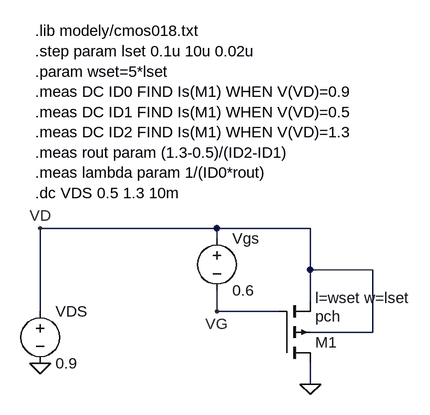
[diagram p0: schematic P1-mos.asc]
P1-mos.asc, the LTspice schematic file:
Version 4
SHEET 1 880 680
WIRE 80 64 -192 64
WIRE 224 64 80 64
WIRE 80 80 80 64
WIRE 224 128 224 64
WIRE 320 128 224 128
WIRE 224 176 224 128
WIRE -192 192 -192 64
WIRE 80 192 80 160
WIRE 176 192 80 192
WIRE 320 224 320 128
WIRE 320 224 224 224
WIRE 224 304 224 272
FLAG 224 304 0
FLAG -192 272 0
FLAG -192 64 VD
FLAG 80 192 VG
SYMBOL voltage 80 64 R0
WINDOW 123 0 0 Left 0
WINDOW 39 0 0 Left 0
SYMATTR InstName Vgs
SYMATTR Value 0.6
SYMBOL voltage -192 176 R0
WINDOW 123 0 0 Left 0
WINDOW 39 0 0 Left 0
SYMATTR InstName VDS
SYMATTR Value 0.9
SYMBOL pmos4 176 272 M180
WINDOW 123 56 101 Left 2
SYMATTR Value2 l=wset w=lset
SYMATTR InstName M1
SYMATTR Value pch
TEXT -200 -240 Left 2 !.lib modely/cmos018.txt\n.step param lset 0.1u 10u 0.02u\n.param wset=5*lset\n.meas DC ID0 FIND Is(M1) WHEN V(VD)=0.9\n.meas DC ID1 FIND Is(M1) WHEN V(VD)=0.5\n.meas DC ID2 FIND Is(M1) WHEN V(VD)=1.3\n.meas rout param (1.3-0.5)/(ID2-ID1)\n.meas lambda param 1/(ID0*rout)\n.dc VDS 0.5 1.3 10m

The netlist it stands for:
* P1-mos.asc
Vgs VD VG 0.6
VDS VD 0 0.9
M1 0 VG VD VD pch l=wset w=lset
.model NMOS NMOS
.model PMOS PMOS
.lib standard.mos
.lib modely/cmos018.txt
.step param lset 0.1u 10u 0.02u
.param wset=5*lset
.meas DC ID0 FIND Is(M1) WHEN V(VD)=0.9
.meas DC ID1 FIND Is(M1) WHEN V(VD)=0.5
.meas DC ID2 FIND Is(M1) WHEN V(VD)=1.3
.meas rout param (1.3-0.5)/(ID2-ID1)
.meas lambda param 1/(ID0*rout)
.dc VDS 0.5 1.3 10m
.backanno
.end

* Results of the author's LTspice run, read from the files saved beside the schematic
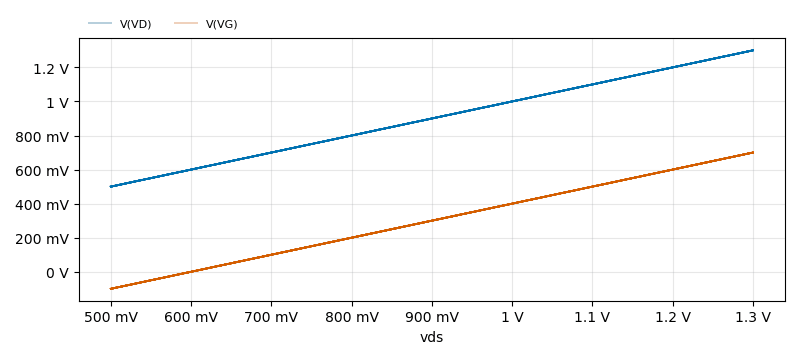
[diagram p1: DC transfer characteristic of P1-mos.asc, plotted from the saved traces]
* DC transfer characteristic, 496 runs:
*   V(VD) [run 1]: 500 mV at vds=500 mV, 1.3 V at vds=1.3 V, min 500 mV, max 1.3 V
*   V(VD) [run 2]: 500 mV at vds=500 mV, 1.3 V at vds=1.3 V, min 500 mV, max 1.3 V
*   V(VD) [run 3]: 500 mV at vds=500 mV, 1.3 V at vds=1.3 V, min 500 mV, max 1.3 V
*   V(VD) [run 4]: 500 mV at vds=500 mV, 1.3 V at vds=1.3 V, min 500 mV, max 1.3 V
*   V(VD) [run 5]: 500 mV at vds=500 mV, 1.3 V at vds=1.3 V, min 500 mV, max 1.3 V
*   V(VD) [run 6]: 500 mV at vds=500 mV, 1.3 V at vds=1.3 V, min 500 mV, max 1.3 V
*   V(VD) [run 7]: 500 mV at vds=500 mV, 1.3 V at vds=1.3 V, min 500 mV, max 1.3 V
*   V(VD) [run 8]: 500 mV at vds=500 mV, 1.3 V at vds=1.3 V, min 500 mV, max 1.3 V
*   V(VG) [run 1]: -100 mV at vds=500 mV, 700 mV at vds=1.3 V, min -100 mV, max 700 mV
*   V(VG) [run 2]: -100 mV at vds=500 mV, 700 mV at vds=1.3 V, min -100 mV, max 700 mV
*   V(VG) [run 3]: -100 mV at vds=500 mV, 700 mV at vds=1.3 V, min -100 mV, max 700 mV
*   V(VG) [run 4]: -100 mV at vds=500 mV, 700 mV at vds=1.3 V, min -100 mV, max 700 mV
*   V(VG) [run 5]: -100 mV at vds=500 mV, 700 mV at vds=1.3 V, min -100 mV, max 700 mV
*   V(VG) [run 6]: -100 mV at vds=500 mV, 700 mV at vds=1.3 V, min -100 mV, max 700 mV
*   V(VG) [run 7]: -100 mV at vds=500 mV, 700 mV at vds=1.3 V, min -100 mV, max 700 mV
*   V(VG) [run 8]: -100 mV at vds=500 mV, 700 mV at vds=1.3 V, min -100 mV, max 700 mV
* From the log:
*   Measurement: id0
*     step  is(m1)  at
*        1  3.40096e-07  0.9
*        2  2.99912e-07  0.9
*        3  2.74383e-07  0.9
*        4  2.58859e-07  0.9
*        5  2.49172e-07  0.9
*        6  2.42935e-07  0.9
*        7  2.3881e-07  0.9
*        8  2.36023e-07  0.9
*        9  2.3411e-07  0.9
*       10  2.32783e-07  0.9
*       11  2.31857e-07  0.9
*       12  2.31213e-07  0.9
*       13  2.30771e-07  0.9
*       14  2.30473e-07  0.9
*       15  2.30283e-07  0.9
*       16  2.30173e-07  0.9
*       17  2.30122e-07  0.9
*       18  2.30117e-07  0.9
*       19  2.30146e-07  0.9
*       20  2.30201e-07  0.9
*       21  2.30277e-07  0.9
*       22  2.30367e-07  0.9
*       23  2.3047e-07  0.9
*       24  2.30581e-07  0.9
*       25  2.30699e-07  0.9
*       26  2.30821e-07  0.9
*       27  2.30947e-07  0.9
*       28  2.31075e-07  0.9
*       29  2.31204e-07  0.9
*       30  2.31334e-07  0.9
*       31  2.31463e-07  0.9
*       32  2.31592e-07  0.9
*       33  2.31721e-07  0.9
*       34  2.31848e-07  0.9
*       35  2.31973e-07  0.9
*       36  2.32098e-07  0.9
*       37  2.3222e-07  0.9
*       38  2.3234e-07  0.9
*       39  2.32459e-07  0.9
*       40  2.32576e-07  0.9
*     ...
*   Measurement: id1
*     step  is(m1)  at
*        1  3.12535e-07  0.5
*        2  2.77768e-07  0.5
*        3  2.56002e-07  0.5
*        4  2.43023e-07  0.5
*        5  2.35135e-07  0.5
*        6  2.30233e-07  0.5
*        7  2.2714e-07  0.5
*        8  2.25175e-07  0.5
*        9  2.23936e-07  0.5
*       10  2.23173e-07  0.5
*       11  2.22728e-07  0.5
*       12  2.225e-07  0.5
*       13  2.22422e-07  0.5
*       14  2.22446e-07  0.5
*       15  2.22543e-07  0.5
*       16  2.22691e-07  0.5
*       17  2.22874e-07  0.5
*       18  2.23081e-07  0.5
*       19  2.23305e-07  0.5
*       20  2.2354e-07  0.5
*       21  2.2378e-07  0.5
*       22  2.24025e-07  0.5
*       23  2.2427e-07  0.5
*       24  2.24514e-07  0.5
*       25  2.24757e-07  0.5
*       26  2.24997e-07  0.5
*       27  2.25233e-07  0.5
*       28  2.25465e-07  0.5
*       29  2.25693e-07  0.5
*       30  2.25916e-07  0.5
*       31  2.26134e-07  0.5
*       32  2.26348e-07  0.5
*       33  2.26557e-07  0.5
*       34  2.26761e-07  0.5
*       35  2.2696e-07  0.5
*       36  2.27154e-07  0.5
*       37  2.27344e-07  0.5
*       38  2.27529e-07  0.5
*       39  2.2771e-07  0.5
*       40  2.27887e-07  0.5
*     ...
*   Measurement: id2
*     step  is(m1)  at
*        1  3.68242e-07  1.3
*        2  3.22519e-07  1.3
*        3  2.93116e-07  1.3
*        4  2.74967e-07  1.3
*        5  2.63422e-07  1.3
*        6  2.55807e-07  1.3
*        7  2.50619e-07  1.3
*        8  2.46984e-07  1.3
*        9  2.44376e-07  1.3
*       10  2.42467e-07  1.3
*       11  2.41046e-07  1.3
*       12  2.39974e-07  1.3
*       13  2.39156e-07  1.3
*       14  2.38528e-07  1.3
*       15  2.38043e-07  1.3
*       16  2.37667e-07  1.3
*       17  2.37376e-07  1.3
*       18  2.37151e-07  1.3
*       19  2.3698e-07  1.3
*       20  2.36851e-07  1.3
*       21  2.36757e-07  1.3
*       22  2.3669e-07  1.3
*       23  2.36646e-07  1.3
*       24  2.3662e-07  1.3
*       25  2.36609e-07  1.3
*       26  2.36611e-07  1.3
*       27  2.36624e-07  1.3
*       28  2.36645e-07  1.3
*       29  2.36673e-07  1.3
*       30  2.36706e-07  1.3
*       31  2.36745e-07  1.3
*       32  2.36787e-07  1.3
*       33  2.36833e-07  1.3
*       34  2.36881e-07  1.3
*       35  2.36931e-07  1.3
*       36  2.36983e-07  1.3
*       37  2.37036e-07  1.3
*       38  2.3709e-07  1.3
*       39  2.37145e-07  1.3
*       40  2.372e-07  1.3
*     ...
*   Measurement: rout
*     step  (1.3-0.5)/(id2-id1)
*        1  1.4361e+07
*        2  1.78766e+07
*        3  2.15549e+07
*        4  2.50436e+07
*        5  2.8282e+07
*        6  3.12818e+07
*        7  3.40721e+07
*        8  3.66827e+07
*        9  3.91396e+07
*       10  4.14644e+07
*       11  4.36745e+07
*       12  4.57841e+07
*       13  4.78046e+07
*       14  4.97459e+07
*       15  5.16156e+07
*       16  5.34204e+07
*       17  5.51664e+07
*       18  5.68582e+07
*       19  5.85003e+07
*       20  6.00966e+07
*       21  6.16503e+07
*       22  6.31647e+07
*       23  6.46422e+07
*       24  6.60855e+07
*       25  6.74968e+07
*       26  6.88781e+07
*       27  7.02313e+07
*       28  7.15582e+07
*       29  7.28603e+07
*       30  7.41391e+07
*       31  7.53959e+07
*       32  7.6632e+07
*       33  7.78485e+07
*       34  7.90467e+07
*       35  8.02272e+07
*       36  8.13914e+07
*       37  8.25397e+07
*       38  8.36736e+07
*       39  8.47932e+07
*       40  8.58997e+07
*     ...
*   Measurement: lambda
*     step  1/(id0*rout)
*        1  0.204746
*        2  0.186518
*        3  0.169082
*        4  0.154255
*        5  0.141903
*        6  0.131588
*        7  0.122899
*        8  0.1155
*        9  0.109135
*       10  0.103603
*       11  0.0987533
*       12  0.0944654
*       13  0.0906461
*       14  0.0872212
*       15  0.0841311
*       16  0.0813277
*       17  0.0787711
*       18  0.076429
*       19  0.0742743
*       20  0.0722841
*       21  0.0704393
*       22  0.0687235
*       23  0.0671227
*       24  0.0656252
*       25  0.0642202
*       26  0.0628989
*       27  0.0616534
*       28  0.0604767
*       29  0.0593627
*       30  0.0583061
*       31  0.0573021
*       32  0.0563463
*       33  0.0554351
*       34  0.0545649
*       35  0.0537329
*       36  0.052936
*       37  0.052172
*       38  0.0514383
*       39  0.0507332
*       40  0.0500546
*     ...